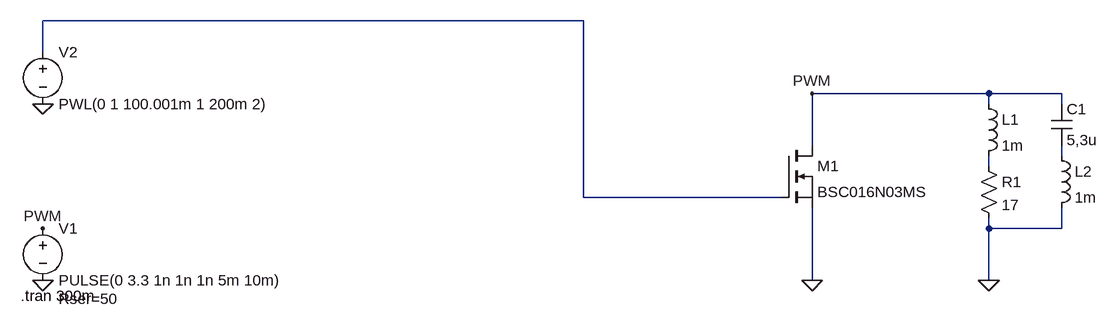
[diagram p0: schematic directDriveViaN_JFet.asc]
directDriveViaN_JFet.asc, the LTspice schematic file:
Version 4
SHEET 1 1600 680
WIRE 800 -208 -32 -208
WIRE -32 -160 -32 -208
WIRE 1424 -96 1152 -96
WIRE 1536 -96 1424 -96
WIRE 1424 -80 1424 -96
WIRE 1536 -80 1536 -96
WIRE 1152 -16 1152 -96
WIRE 1536 0 1536 -16
WIRE 1424 16 1424 0
WIRE 800 64 800 -208
WIRE 1104 64 800 64
WIRE 1424 112 1424 96
WIRE 1536 112 1536 80
WIRE 1536 112 1424 112
WIRE 1152 192 1152 80
WIRE 1424 192 1424 112
FLAG -32 192 0
FLAG -32 112 PWM
FLAG -32 -80 0
FLAG 1424 192 0
FLAG 1152 192 0
FLAG 1152 -96 PWM
SYMBOL voltage -32 96 R0
WINDOW 123 0 0 Left 0
WINDOW 39 24 124 Left 2
SYMATTR InstName V1
SYMATTR Value PULSE(0 3.3 1n 1n 1n 5m 10m)
SYMATTR SpiceLine Rser=50
SYMBOL nmos 1104 -16 R0
SYMATTR InstName M1
SYMATTR Value BSC016N03MS
SYMBOL voltage -32 -176 R0
WINDOW 123 0 0 Left 0
WINDOW 39 0 0 Left 0
SYMATTR InstName V2
SYMATTR Value PWL(0 1 100.001m 1 200m 2)
SYMBOL res 1408 0 R0
SYMATTR InstName R1
SYMATTR Value 17
SYMBOL ind 1408 -96 R0
SYMATTR InstName L1
SYMATTR Value 1m
SYMBOL cap 1520 -80 R0
SYMATTR InstName C1
SYMATTR Value 5,3u
SYMBOL ind 1520 -16 R0
SYMATTR InstName L2
SYMATTR Value 1m
TEXT -66 216 Left 2 !.tran 300m

The netlist it stands for:
* directDriveViaN_JFet.asc
V1 PWM 0 PULSE(0 3.3 1n 1n 1n 5m 10m) Rser=50
M1 PWM N001 0 0 BSC016N03MS
V2 N001 0 PWL(0 1 100.001m 1 200m 2)
R1 N003 0 17
L1 PWM N003 1m
C1 PWM N002 5,3u
L2 N002 0 1m
.model NMOS NMOS
.model PMOS PMOS
.lib standard.mos
.tran 300m
.backanno
.end